# Altium schematic sheet AT Guard Simple Power.SchDoc
size A
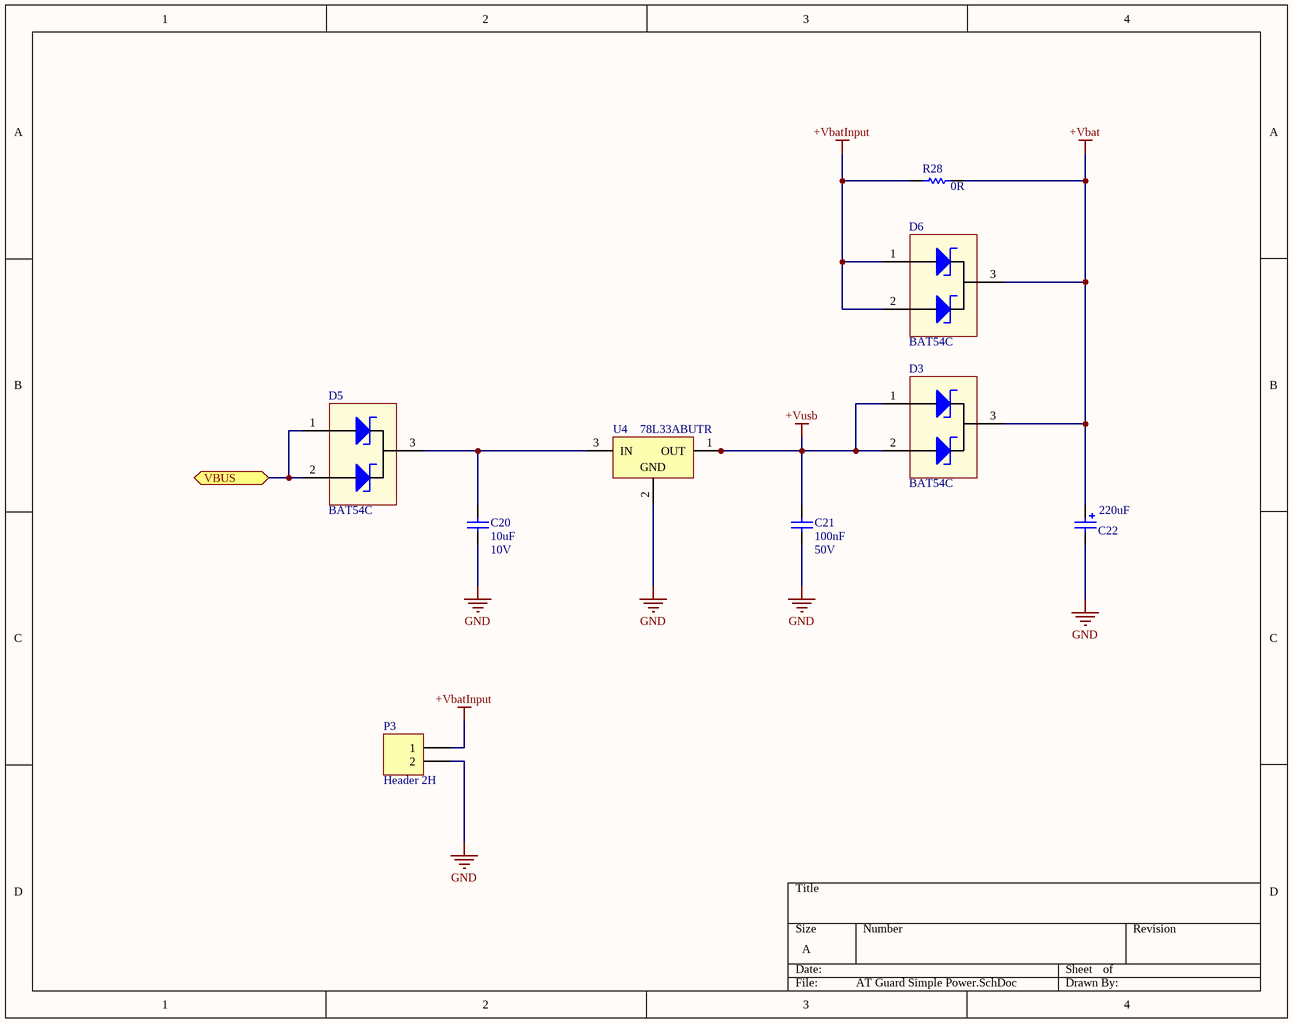
[diagram p0: AT Guard Simple Power.SchDoc]

## Parts
C20  value 10uF  Voltage: 10V  [3-0603_L]  (hidden comment: Cap)
C21  value 100nF  Voltage: 50V  [3-0603_L]  (hidden comment: Cap)
C22  value 220uF  [C]  (hidden comment: CAP-Tantal)
D3  BAT54C  [SOT23_N]
D5  BAT54C  [SOT23_N]
D6  BAT54C  [SOT23_N]
P3  Header 2H  [HDR1X2H-180 derece]
R28  value 0R  [6-0805_N]  (hidden comment: Res1)
U4  78L33ABUTR  [SOT89M]

## Ports
VBUS

## Nets
+Vbat: C22.1 D3.3(A) D6.3(A) R28.2
+VbatInput: D6.1(K1) D6.2(K2) P3.1 R28.1
+Vusb: C21.2 D3.1(K1) D3.2(K2) U4.1(OUT)
GND: C20.1 C21.1 C22.2 P3.2 U4.2(GND)
VBUS: D5.1(K1) D5.2(K2) ; port VBUS
NetC20_2: C20.2 D5.3(A) U4.3(IN)

## Library data of the parts
C20 C21 = Cap: Capacitor; Published: 8-Jun-2000; Revision: July-2002: Re-released for DXP Platform.; Publisher: Altium Limited
C22 = CAP-Tantal: Tantamount Military, Surface Mount MIL-PRF-55365/8 Qualified Solid Tantalum Chip Capacitor: 6.8uF, 20% Tolerance, 6 WVDC @ +85°C, Surge = 8V; Note: See Data Sheet for full range of components; Voltage: 6.3V; Published: 19-Mar-2004; DatasheetDocument: 20-Mar-2003; PackageReference: 3528; Publisher: Altium Limited; Code_JEITA: 3528; ComponentLink1Description: Manufacturer Link; ComponentLink1URL: http://www.vishay.com/; ComponentLink2Description: Datasheet; ComponentLink2URL: http://www.vishay.com/docs/40011/cwr11.pdf
D3 D5 D6 = BAT54C: 2x200 mA Shottky Rectifier; Published: 8-Jun-2000; LatestRevisionDate: 17-Jul-2002; LatestRevisionNote: Re-released for DXP Platform.; DatasheetDocument: 1998; PackageDocument: Aug-1999; PackageReference: DO-41; Publisher: Altium Limited; Code_JEDEC: DO-204-AL; ComponentLink1Description: Manufacturer Link; ComponentLink1URL: http://www.fairchildsemi.com/; ComponentLink2Description: Datasheet; ComponentLink2URL: http://www.fairchildsemi.com/ds/1N%2F1N4001.pdf
P3 = Header 2H: Header, 2-Pin, Right Angle; LatestRevisionDate: 17-Jul-2002; LatestRevisionNote: Re-released for DXP Platform.; Publisher: Altium Limited
R28 = Res1: Resistor; Published: 8-Jun-2000; LatestRevisionDate: 17-Jul-2002; LatestRevisionNote: Re-released for DXP Platform.; PackageReference: AXIAL-0.3; Publisher: Altium Limited
U4 = 78L33ABUTR: Precision 500mA Regulator; Published: 24-Aug-2001; LatestRevisionDate: 06-Jun-2005; LatestRevisionNote: PCB pads lengthened.; DatasheetVersion: Mar-1997; PackageVersion: Jun-2004; PackageReference: TO-252; Publisher: Altium Limited; PackageDescription: D-PAK/TO-252-AA; 3 Leads (1 Cropped); Body 10.1 (inc. leads) x 6.6 mm (LxW max); ComponentLink1Description: Manufacturer Link; ComponentLink1URL: http://www.st.com/; ComponentLink2Description: Datasheet; ComponentLink2URL: http://www.st.com/stonline/products/literature/ds/2147/l78m05ab.pdf